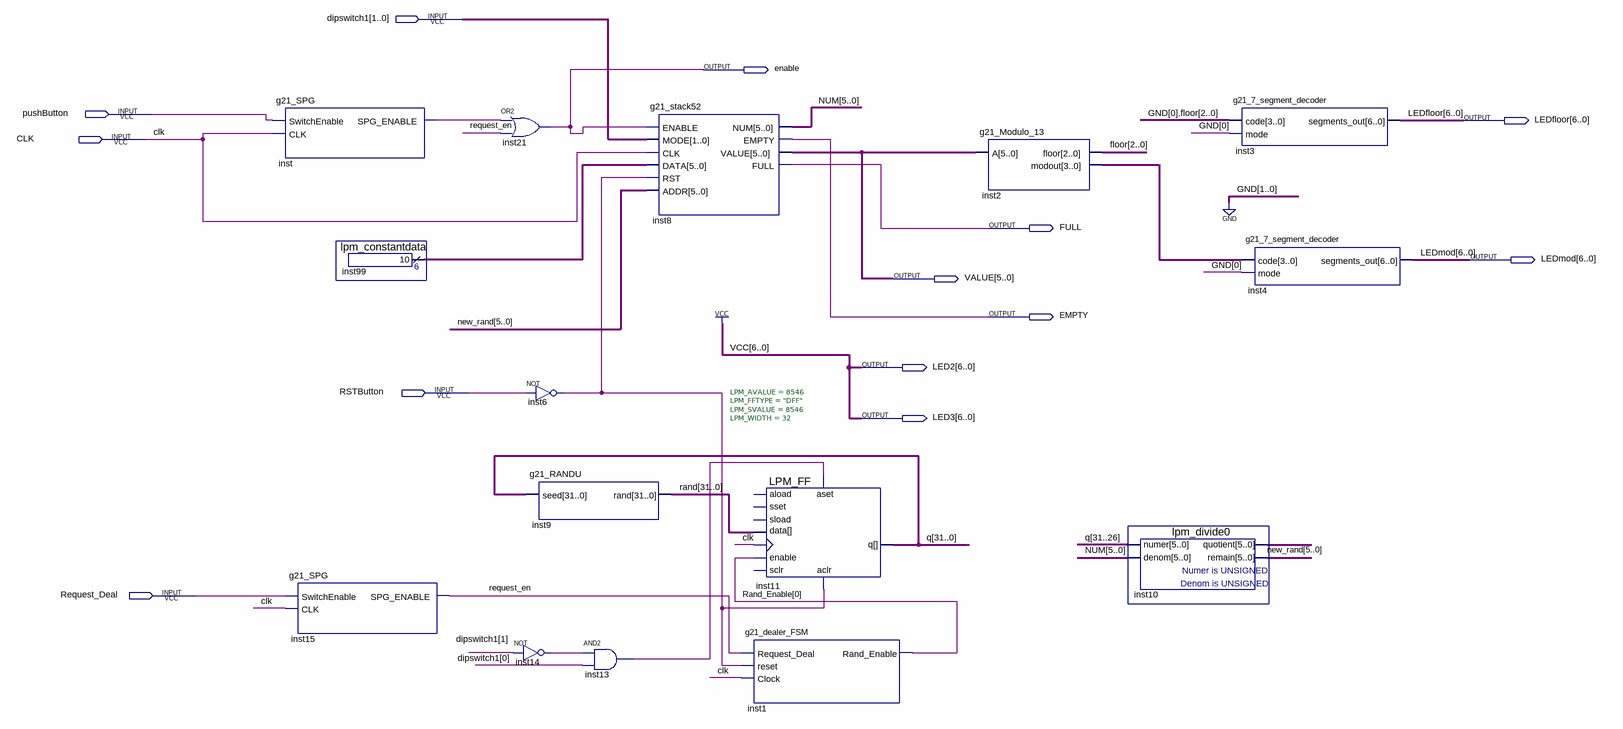
[diagram p0: schematic sheet]
// Quartus schematic g21_test_bed_lab4.bdf as structural Verilog: 15 symbols, 13 pins
module g21_test_bed_lab4 (
  input  [1:0] dipswitch1,
  input  pushButton,
  input  CLK,
  input  RSTButton,
  input  Request_Deal,
  output enable,
  output [6:0] LEDfloor,
  output FULL,
  output [6:0] LEDmod,
  output [5:0] VALUE,
  output EMPTY,
  output [6:0] LED2,
  output [6:0] LED3
);

  wire inst6_out, inst13_out, inst14_out, inst_spg_enable, request_en;
  wire [0:0] Rand_Enable;
  wire [2:0] floor;
  wire [3:0] inst2_modout;
  wire [5:0] inst10_quotient, inst99_result, new_rand, NUM;
  wire [31:0] q, \rand ;

  g21_SPG inst (.SwitchEnable(pushButton), .CLK(CLK), .SPG_ENABLE(inst_spg_enable));
  g21_SPG inst15 (.SwitchEnable(Request_Deal), .CLK(CLK), .SPG_ENABLE(request_en));
  lpm_constantdata inst99 (.result(inst99_result));
  or inst21 (enable, inst_spg_enable, request_en);
  not inst6 (inst6_out, RSTButton);
  g21_RANDU inst9 (.seed(q), .\rand (\rand ));
  not inst14 (inst14_out, dipswitch1[1]);
  and inst13 (inst13_out, inst14_out, dipswitch1[0]);
  g21_stack52 inst8 (
    .ENABLE(enable), .MODE(dipswitch1), .CLK(CLK), .DATA(inst99_result), .RST(inst6_out), .ADDR(new_rand),
    .NUM(NUM), .EMPTY(EMPTY), .VALUE(VALUE), .FULL(FULL));
  g21_dealer_FSM inst1 (.Request_Deal(request_en), .reset(inst6_out), .Clock(CLK), .Rand_Enable(Rand_Enable[0]));
  LPM_FF #(.LPM_AVALUE(8546), .LPM_FFTYPE("DFF"), .LPM_SVALUE(8546), .LPM_WIDTH(32)) inst11 (
    .enable(Rand_Enable[0]), .clock(CLK), .aset(inst13_out), .aclr(inst6_out), .data(\rand ), .q(q));  // open: aload, sset, sload, sclr
  g21_Modulo_13 inst2 (.A(VALUE), .floor(floor), .modout(inst2_modout));
  lpm_divide0 inst10 (.numer(q[31:26]), .denom(NUM), .quotient(inst10_quotient), .remain(new_rand));
  g21_7_segment_decoder inst3 (.code({1'b0, floor}), .mode(1'b0), .segments_out(LEDfloor));
  g21_7_segment_decoder inst4 (.code(inst2_modout), .mode(1'b0), .segments_out(LEDmod));

  assign LED2 = {7{1'b1}};
  assign LED3 = {7{1'b1}};
endmodule
